# Altium schematic sheet CPU_IO_Ports.SchDoc: CPU_IO_Ports
size A4; Date: 18/06/2014; DrawnBy: J. Gabriel R.E.; Organization: Seven Solutions S.L.; Address1: C/Baza, Parcela 19, Nave 3; Address2: Polígono Ind. Juncaril; Address3: 18210-Peligros-Granada; Address4: Spain; Revision: 3.4; SheetNumber: 9; SheetTotal: 23; WebAddress: www.sevensols.com; Project: White Rabbit; ProjectName: White Rabbit
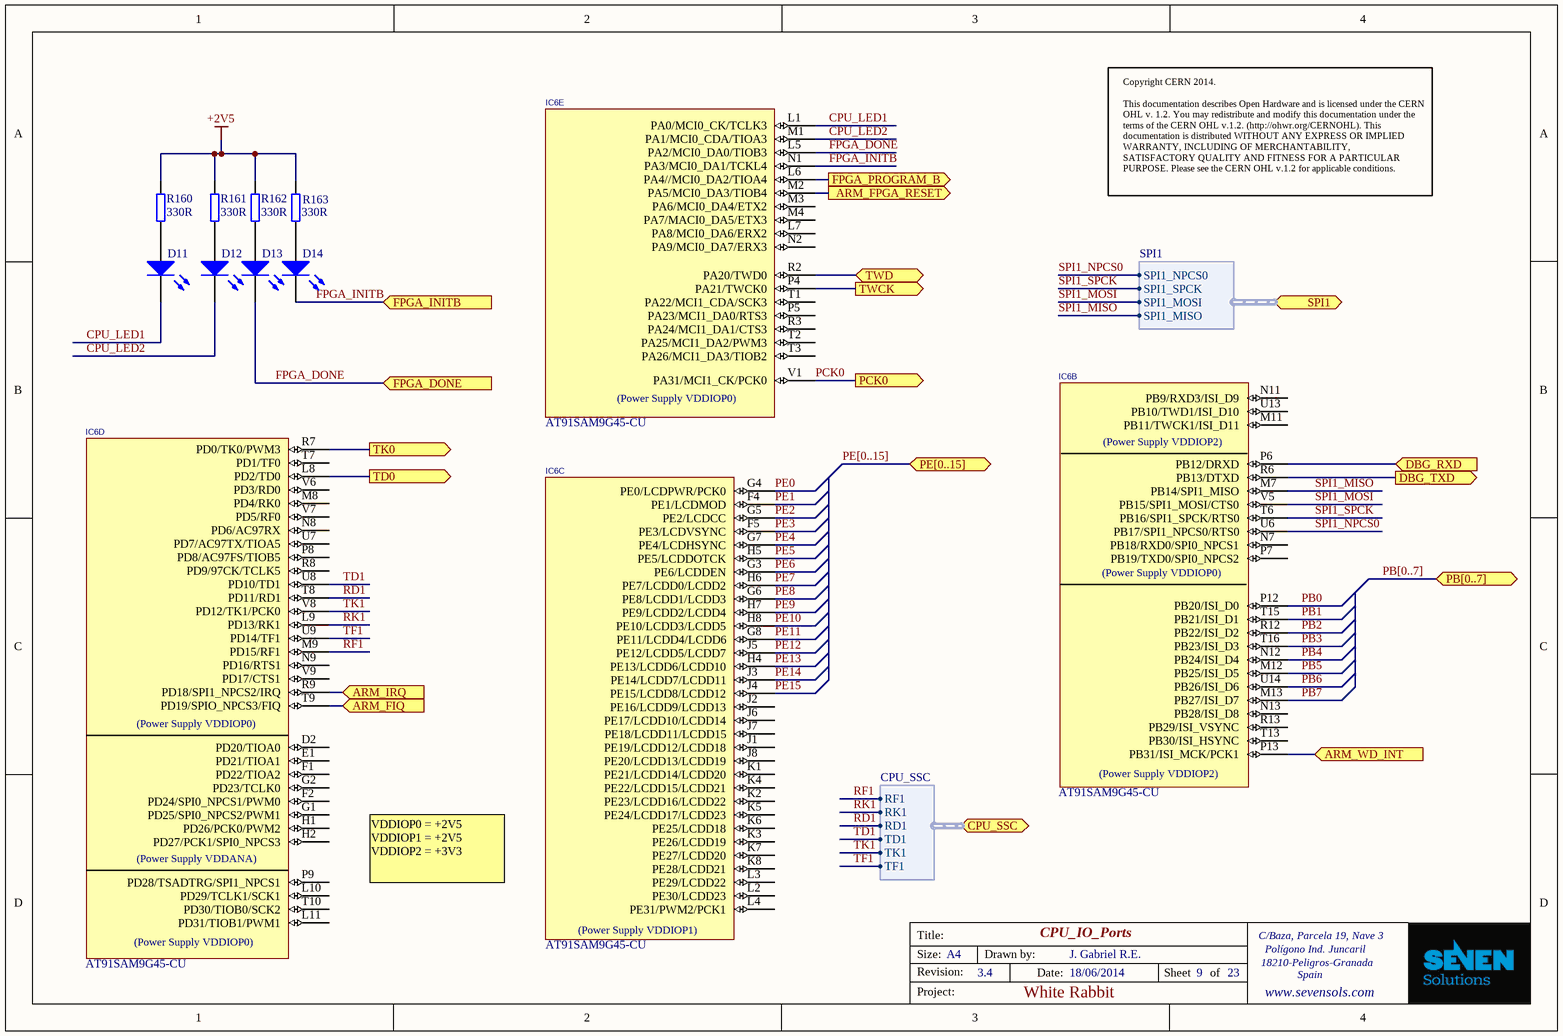
[diagram p0: CPU_IO_Ports.SchDoc]

## Parts
D11  LED  [CD1608-0603]  (value not drawn)
D12  LED  [CD1608-0603]  (value not drawn)
D13  LED  [CD1608-0603]  (value not drawn)
D14  LED  [CD1608-0603]  (value not drawn)
IC6  AT91SAM9G45-CU  [TFBGA324]  (parts B,C,D,E of 12)
R160  330R  [0402]
R161  330R  [0402]
R162  330R  [0402]
R163  330R  [0402]

## Ports
ARM_FIQ (in), ARM_FPGA_RESET (out), ARM_IRQ (in), ARM_WD_INT (in), CPU_SSC (harness CPU_SSC), DBG_RXD (in), DBG_TXD (out), FPGA_DONE (in), FPGA_INITB (in), FPGA_PROGRAM_B (out), PB[0..7] (bidir), PCK0 (out), PE[0..15] (bidir), SPI1 (harness SPI1), TD0 (out), TK0 (out), TWCK (out), TWD (bidir)

## Harnesses
CPU_SSC: TF1, TK1, TD1, RD1, RK1, RF1
SPI1: SPI1_MISO, SPI1_MOSI, SPI1_SPCK, SPI1_NPCS0

## Nets
+2V5: R160.2 R161.2 R162.2 R163.2
ARM_FIQ: IC6.T9(PD19/SPIO_NPCS3/FIQ) ; port ARM_FIQ
ARM_FPGA_RESET: IC6.M2(PA5/MCI0_DA3/TIOB4) ; port ARM_FPGA_RESET
ARM_IRQ: IC6.R9(PD18/SPI1_NPCS2/IRQ) ; port ARM_IRQ
ARM_WD_INT: IC6.P13(PB31/ISI_MCK/PCK1) ; port ARM_WD_INT
CPU_LED1: D11.2(K) IC6.L1(PA0/MCI0_CK/TCLK3)
CPU_LED2: D12.2(K) IC6.M1(PA1/MCI0_CDA/TIOA3)
DBG_RXD: IC6.P6(PB12/DRXD) ; port DBG_RXD
DBG_TXD: IC6.R6(PB13/DTXD) ; port DBG_TXD
FPGA_DONE: D13.2(K) IC6.L5(PA2/MCI0_DA0/TIOB3) ; port FPGA_DONE
FPGA_INITB: D14.2(K) IC6.N1(PA3/MCI0_DA1/TCKL4) ; port FPGA_INITB
FPGA_PROGRAM_B: IC6.L6(PA4//MCI0_DA2/TIOA4) ; port FPGA_PROGRAM_B
PB0: IC6.P12(PB20/ISI_D0)
PB1: IC6.T15(PB21/ISI_D1)
PB2: IC6.R12(PB22/ISI_D2)
PB3: IC6.T16(PB23/ISI_D3)
PB4: IC6.N12(PB24/ISI_D4)
PB5: IC6.M12(PB25/ISI_D5)
PB6: IC6.U14(PB26/ISI_D6)
PB7: IC6.M13(PB27/ISI_D7)
PCK0: IC6.V1(PA31/MCI1_CK/PCK0) ; port PCK0
PE0: IC6.G4(PE0/LCDPWR/PCK0)
PE1: IC6.F4(PE1/LCDMOD)
PE2: IC6.G5(PE2/LCDCC)
PE3: IC6.F5(PE3/LCDVSYNC)
PE4: IC6.G7(PE4/LCDHSYNC)
PE5: IC6.H5(PE5/LCDDOTCK)
PE6: IC6.G3(PE6/LCDDEN)
PE7: IC6.H6(PE7/LCDD0/LCDD2)
PE8: IC6.G6(PE8/LCDD1/LCDD3)
PE9: IC6.H7(PE9/LCDD2/LCDD4)
PE10: IC6.H8(PE10/LCDD3/LCDD5)
PE11: IC6.G8(PE11/LCDD4/LCDD6)
PE12: IC6.J5(PE12/LCDD5/LCDD7)
PE13: IC6.H4(PE13/LCDD6/LCDD10)
PE14: IC6.J3(PE14/LCDD7/LCDD11)
PE15: IC6.J4(PE15/LCDD8/LCDD12)
RD1: IC6.T8(PD11/RD1) ; port CPU_SSC.RD1
RF1: IC6.M9(PD15/RF1) ; port CPU_SSC.RF1
RK1: IC6.L9(PD13/RK1) ; port CPU_SSC.RK1
SPI1_MISO: IC6.M7(PB14/SPI1_MISO) ; port SPI1.SPI1_MISO
SPI1_MOSI: IC6.V5(PB15/SPI1_MOSI/CTS0) ; port SPI1.SPI1_MOSI
SPI1_NPCS0: IC6.U6(PB17/SPI1_NPCS0/RTS0) ; port SPI1.SPI1_NPCS0
SPI1_SPCK: IC6.T6(PB16/SPI1_SPCK/RTS0) ; port SPI1.SPI1_SPCK
TD0: IC6.L8(PD2/TD0) ; port TD0
TD1: IC6.U8(PD10/TD1) ; port CPU_SSC.TD1
TF1: IC6.U9(PD14/TF1) ; port CPU_SSC.TF1
TK0: IC6.R7(PD0/TK0/PWM3) ; port TK0
TK1: IC6.V8(PD12/TK1/PCK0) ; port CPU_SSC.TK1
TWCK: IC6.P4(PA21/TWCK0) ; port TWCK
TWD: IC6.R2(PA20/TWD0) ; port TWD
NetD11_1: D11.1(A) R160.1
NetD12_1: D12.1(A) R161.1
NetD13_1: D13.1(A) R162.1
NetD14_1: D14.1(A) R163.1

Not connected (* = marked no-connect by the designer): IC6 D2(PD20/TIOA0) E1(PD21/TIOA1) F1(PD22/TIOA2) F2(PD24/SPI0_NPCS1/PWM0) G1(PD25/SPI0_NPCS2/PWM1) G2(PD23/TCLK0) H1(PD26/PCK0/PWM2) H2(PD27/PCK1/SPI0_NPCS3) J1(PE19/LCDD12/LCDD18) J2(PE16/LCDD9/LCDD13) J6(PE17/LCDD10/LCDD14) J7(PE18/LCDD11/LCDD15) J8(PE20/LCDD13/LCDD19) K1(PE21/LCDD14/LCDD20) K2(PE23/LCDD16/LCDD22) K3(PE26/LCDD19) K4(PE22/LCDD15/LCDD21) K5(PE24/LCDD17/LCDD23) K6(PE25/LCDD18) K7(PE27/LCDD20) K8(PE28/LCDD21) L2(PE30/LCDD23) L3(PE29/LCDD22) L4(PE31/PWM2/PCK1) L7(PA8/MCI0_DA6/ERX2) L10(PD29/TCLK1/SCK1) L11(PD31/TIOB1/PWM1) M3(PA6/MCI0_DA4/ETX2) M4(PA7/MACI0_DA5/ETX3) M8(PD4/RK0) M11(PB11/TWCK1/ISI_D11) N2(PA9/MCI0_DA7/ERX3) N7(PB18/RXD0/SPI0_NPCS1) N8(PD6/AC97RX) N9(PD16/RTS1) N11(PB9/RXD3/ISI_D9) N13(PB28/ISI_D8) P5(PA23/MCI1_DA0/RTS3) P7(PB19/TXD0/SPI0_NPCS2) P8(PD8/AC97FS/TIOB5) P9(PD28/TSADTRG/SPI1_NPCS1) R3(PA24/MCI1_DA1/CTS3) R8(PD9/97CK/TCLK5) R13(PB29/ISI_VSYNC) T1(PA22/MCI1_CDA/SCK3) T2(PA25/MCI1_DA2/PWM3) T3(PA26/MCI1_DA3/TIOB2) T7(PD1/TF0) T10(PD30/TIOB0/SCK2) T13(PB30/ISI_HSYNC) U7(PD7/AC97TX/TIOA5) U13(PB10/TWD1/ISI_D10) V6(PD3/RD0) V7(PD5/RF0) V9(PD17/CTS1)

## Buses and harness runs
bus PB[0..7] = port PB[0..7]
bus PE[0..15] = port PE[0..15]

## Notes on the sheet
- Copyright CERN 2014.
  This documentation describes Open Hardware and is licensed under the CERN OHL v. 1.2. You may redistribute and modify this documentation under the terms of the CERN OHL v.1.2. (http://ohwr.org/CERNOHL). This documentation is distributed WITHOUT ANY EXPRESS OR IMPLIED WARRANTY, INCLUDING OF MERCHANTABILITY, SATISFACTORY QUALITY AND FITNESS FOR A PARTICULAR PURPOSE. Please see the CERN OHL v.1.2 for applicable conditions.
- VDDIOP0 = +2V5
  VDDIOP1 = +2V5
  VDDIOP2 = +3V3
- Title:
- Size:
- Revision:
- A4
- Drawn by:
- Date:
- Sheet
- of
- Project:
- (in symbol AT91SAM9G45-CU, part B) (Power Supply VDDIOP2); (Power Supply VDDIOP0)
- (in symbol AT91SAM9G45-CU, part C) (Power Supply VDDIOP1)
- (in symbol AT91SAM9G45-CU, part D) (Power Supply VDDIOP0); (Power Supply VDDANA)
- (in symbol AT91SAM9G45-CU, part E) (Power Supply VDDIOP0)

## Library data of the parts
D11-D14 = LED0: Typical INFRARED GaAs LED; Value: LG L29K-G2J1-24-Z; Published: 8-Jun-2000; LatestRevisionDate: 08-Jul-2005; LatestRevisionNote: Mech Layer 1 removed.; PackageReference: LED-0; Publisher: Altium Limited; Distributor1: Digikey; Distributor1 PN: 475-2709-1-ND
IC6 = AT91SAM9G45-CU: Atmel 400MHz ARM926 MCU; Value: AT91SAM9G45-CU; Distributor1 PN: AT91SAM9G45-CU-ND; Distributor1: Digikey
R160-R163 = R0402_330R_±1%_0.1W_100PPM: SMD Resistor; Manufacturer1: Panasonic; Manufacturer1 PN: ERJ-2RKF3300X; TCR: 100ppm; Power Rating: 0.1W; Tolerance: ±1%; Case: 0402; Distributor1: DigiKey; Distributor1 PN: P330LCT-ND; Value: 330R